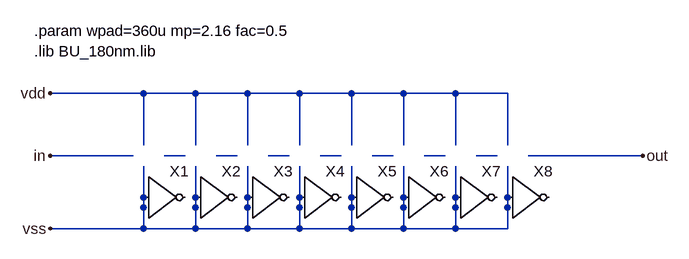
[diagram p0: schematic pad_buffer.asc]
pad_buffer.asc, the LTspice schematic file:
Version 4
SHEET 1 1168 680
WIRE 128 224 -16 224
WIRE 208 224 128 224
WIRE 288 224 208 224
WIRE 368 224 288 224
WIRE 448 224 368 224
WIRE 528 224 448 224
WIRE 608 224 528 224
WIRE 688 224 608 224
WIRE 128 304 128 224
WIRE 208 304 208 224
WIRE 288 304 288 224
WIRE 368 304 368 224
WIRE 448 304 448 224
WIRE 528 304 528 224
WIRE 608 304 608 224
WIRE 688 304 688 224
WIRE 112 320 -16 320
WIRE 192 320 160 320
WIRE 272 320 240 320
WIRE 352 320 320 320
WIRE 432 320 400 320
WIRE 512 320 480 320
WIRE 592 320 560 320
WIRE 672 320 640 320
WIRE 896 320 720 320
WIRE 128 432 128 336
WIRE 128 432 -16 432
WIRE 208 432 208 336
WIRE 208 432 128 432
WIRE 288 432 288 336
WIRE 288 432 208 432
WIRE 368 432 368 336
WIRE 368 432 288 432
WIRE 448 432 448 336
WIRE 448 432 368 432
WIRE 528 432 528 336
WIRE 528 432 448 432
WIRE 608 432 608 336
WIRE 608 432 528 432
WIRE 688 432 688 336
WIRE 688 432 608 432
FLAG -16 224 vdd
FLAG -16 320 in
FLAG 896 320 out
FLAG -16 432 vss
SYMBOL inv 128 320 R0
SYMATTR InstName X1
SYMATTR SpiceLine ll=180n wn={wpad*fac*fac*fac*fac*fac*fac*fac} wp={wpad * mp*fac*fac*fac*fac*fac*fac*fac}
SYMBOL inv 208 320 R0
SYMATTR InstName X2
SYMATTR SpiceLine ll=180n wn={wpad*fac*fac*fac*fac*fac*fac} wp={wpad * mp*fac*fac*fac*fac*fac*fac}
SYMBOL inv 288 320 R0
SYMATTR InstName X3
SYMATTR SpiceLine ll=180n wn={wpad*fac*fac*fac*fac*fac} wp={wpad * mp*fac*fac*fac*fac*fac}
SYMBOL inv 368 320 R0
SYMATTR InstName X4
SYMATTR SpiceLine ll=180n wn={wpad*fac*fac*fac*fac} wp={wpad * mp*fac*fac*fac*fac}
SYMBOL inv 448 320 R0
SYMATTR InstName X5
SYMATTR SpiceLine ll=180n wn={wpad*fac*fac*fac} wp={wpad * mp*fac*fac*fac}
SYMBOL inv 528 320 R0
SYMATTR InstName X6
SYMATTR SpiceLine ll=180n wn={wpad*fac*fac} wp={wpad * mp*fac*fac}
SYMBOL inv 608 320 R0
SYMATTR InstName X7
SYMATTR SpiceLine ll=180n wn={wpad*fac} wp={wpad * mp*fac}
SYMBOL inv 688 320 R0
SYMATTR InstName X8
SYMATTR SpiceLine ll=180n wn={wpad} wp={wpad * mp}
TEXT -40 128 Left 2 !.param wpad=360u mp=2.16 fac=0.5\n.lib BU_180nm.lib

The netlist it stands for:
* pad_buffer.asc
A§X1 vss vss vss vss vss vss vss vss BUF ll=180n wn={wpad*fac*fac*fac*fac*fac*fac*fac} wp={wpad * mp*fac*fac*fac*fac*fac*fac*fac}
A§X2 vss vss vss vss vss vss vss vss BUF ll=180n wn={wpad*fac*fac*fac*fac*fac*fac} wp={wpad * mp*fac*fac*fac*fac*fac*fac}
A§X3 vss vss vss vss vss vss vss vss BUF ll=180n wn={wpad*fac*fac*fac*fac*fac} wp={wpad * mp*fac*fac*fac*fac*fac}
A§X4 vss vss vss vss vss vss vss vss BUF ll=180n wn={wpad*fac*fac*fac*fac} wp={wpad * mp*fac*fac*fac*fac}
A§X5 vss vss vss vss vss vss vss vss BUF ll=180n wn={wpad*fac*fac*fac} wp={wpad * mp*fac*fac*fac}
A§X6 vss vss vss vss vss vss vss vss BUF ll=180n wn={wpad*fac*fac} wp={wpad * mp*fac*fac}
A§X7 vss vss vss vss vss vss vss vss BUF ll=180n wn={wpad*fac} wp={wpad * mp*fac}
A§X8 vss vss vss vss vss vss vss vss BUF ll=180n wn={wpad} wp={wpad * mp}
.param wpad=360u mp=2.16 fac=0.5
.lib BU_180nm.lib
.backanno
.end